# Altium schematic sheet USB.SchDoc
size A4; Organization: ENEL429 Group N; Address1: ECE Department; Address2: University of Canterbury; Address3: Christchurch 8041; Address4: New Zealand; Revision: 1
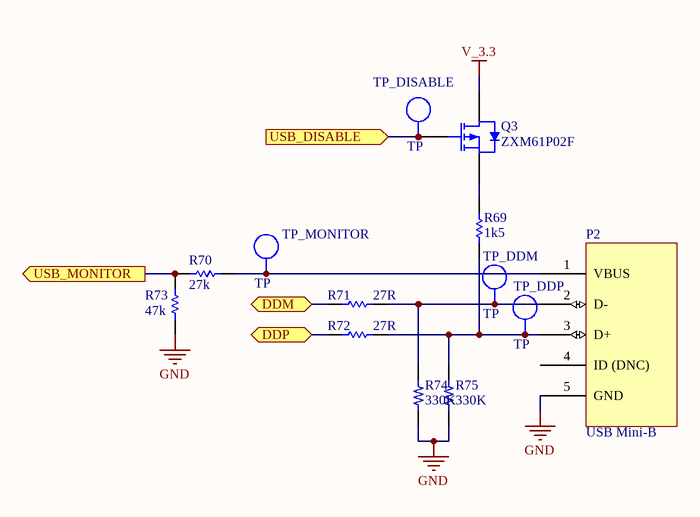
[diagram p0: USB.SchDoc]

## Parts
P2  USB Mini-B  [USB Mini-B]
Q3  ZXM61P02F  [SOT23]
R69  1k5  [0603]
R70  27k  [0603]
R71  27R  [0603]
R72  27R  [0603]
R73  47k  [0603]
R74  330K  [0603 Resistor]
R75  330K  [0603 Resistor]
TP_DDM  TP  [TEST_POINT_4X2MM]  (no BOM)
TP_DDP  TP  [TEST_POINT_4X2MM]  (no BOM)
TP_DISABLE  TP  [TEST_POINT_4X2MM]  (no BOM)
TP_MONITOR  TP  [TEST_POINT_4X2MM]  (no BOM)

## Ports
DDM (bidir), DDP (bidir), USB_DISABLE (in), USB_MONITOR (out)

## Nets
GND: P2.5(GND) R73.1 R74.1 R75.1
V_3.3: Q3.3(D)
DDM: R71.1 ; port DDM
DDP: R72.1 ; port DDP
USB_DISABLE: Q3.1(G) TP_DISABLE.1 ; port USB_DISABLE
USB_MONITOR: R70.1 R73.2 ; port USB_MONITOR
NetP2_1: P2.1(VBUS) R70.2 TP_MONITOR.1
NetP2_2: P2.2(D-) R71.2 R74.2 TP_DDM.1
NetP2_3: P2.3(D+) R69.1 R72.2 R75.2 TP_DDP.1
NetQ3_2: Q3.2(S) R69.2

Not connected (* = marked no-connect by the designer): P2 4(ID_(DNC))

## Notes on the sheet
- Title
- Drawn by:
- Date:
- Time:
- Revision:
- Sheet
- of
- File:

## Library data of the parts
P2 = USB Mini B: Manufacturer: TE Connectivity; Manufacturer Part Number: 1734035-2; Supplier 1: Digikey; Supplier Part Number 1: A31727CT-ND
Q3 = TF_ZXM61P02F: 20V P-channel enhancement mode MOSFET; Manufacturer: Zetex; Supplier 1: Element 14; Supplier Part Number 1: 9525297; price: 1.31; Supplier 2: Digi-Key; Supplier Part Number 2: ZXM61P02FCT-ND; value: ZXM61P02F; Part Number: TF_ZXM61P02F; Component Kind: Standard; Component Type: Standard; Designator: TF_ZXM61P02F; Pin Count: 3; PCB3D: sot23
R69 = RS_1k5 0603: RES 1.5K OHM 1/10W 5% 0603 SMD; Manufacturer: Yageo; Manufacturer PN: RC0603JR-071K5L; Value: 1k5; Part Number: RS_1k5 0603; Component Kind: Standard; Component Type: Standard; Designator: RS_1k5 0603; Pin Count: 2; LatestRevisionDate: 6 May 2011; Supplier 1: Digi-Key; Supplier Part Number 1: 311-1.5KGRTR-ND; Signal Integrity: Res; Simulation: RESISTOR
R70 = RS_27k 0603: RES 27K OHM 1/10W 1% 0603 SMD; Manufacturer: Yageo; Manufacturer PN: RC0603FR-0727KL; LatestRevisionDate: 6 May 2011; Supplier 1: Digi-Key; Supplier Part Number 1: 311-27.0KHRTR-ND; Value: 27k; Part Number: RS_27k 0603; Component Kind: Standard; Component Type: Standard; Designator: RS_27k 0603; Pin Count: 2; Signal Integrity: Res; Simulation: RESISTOR
R71 R72 = RS_27R 0603: RES 27 OHM 1/10W 1% 0603 SMD; Manufacturer: Yageo; Manufacturer PN: RC0603FR-0727KL; Value: 27R; Part Number: RS_27R 0603; Component Kind: Standard; Component Type: Standard; Designator: RS_27R 0603; Pin Count: 2; LatestRevisionDate: 6 May 2011; Supplier 1: Digi-Key; Supplier Part Number 1: 311-27.0HRTR-ND; Signal Integrity: Res; Simulation: RESISTOR
R73 = RS_47k 0603: RES 47.0K OHM 1/10W 1% 0603 SMD; Manufacturer: Yageo; Manufacturer PN: RC0603FR-0747KL; Value: 47k; Part Number: RS_47k 0603; Component Kind: Standard; Component Type: Standard; Designator: RS_47k 0603; Pin Count: 2; LatestRevisionDate: 1 Jun 08; Supplier 1: Digi-Key; Supplier Part Number 1: 311-47.0KHRTR-ND; Signal Integrity: Res; Simulation: RESISTOR
R74 R75 = RS_330K 0603: Manufacturer Part Number: ERJ-3EKF3303V; Manufacturer: Panasonic - ECG; Supplier Part Number 1: P330KHCT-ND; Supplier 1: Digi-Key
TP_DDM TP_DDP TP_DISABLE TP_MONITOR = TP_TESTPOINT: Test-Point; LatestRevisionDate: 29 May 08; Manufacturer PN: *; Manufacturer: *; Supplier 1: Digi-Key; Supplier Part Number 1: 5016KTR-ND; Value: TP; Part Number: TP_TESTPOINT; Component Type: Standard (No BOM); Designator: TP_TESTPOINT; Pin Count: 1